# EAGLE design CristmasVillage Driver 1-3 (EAGLE 6.5.0)
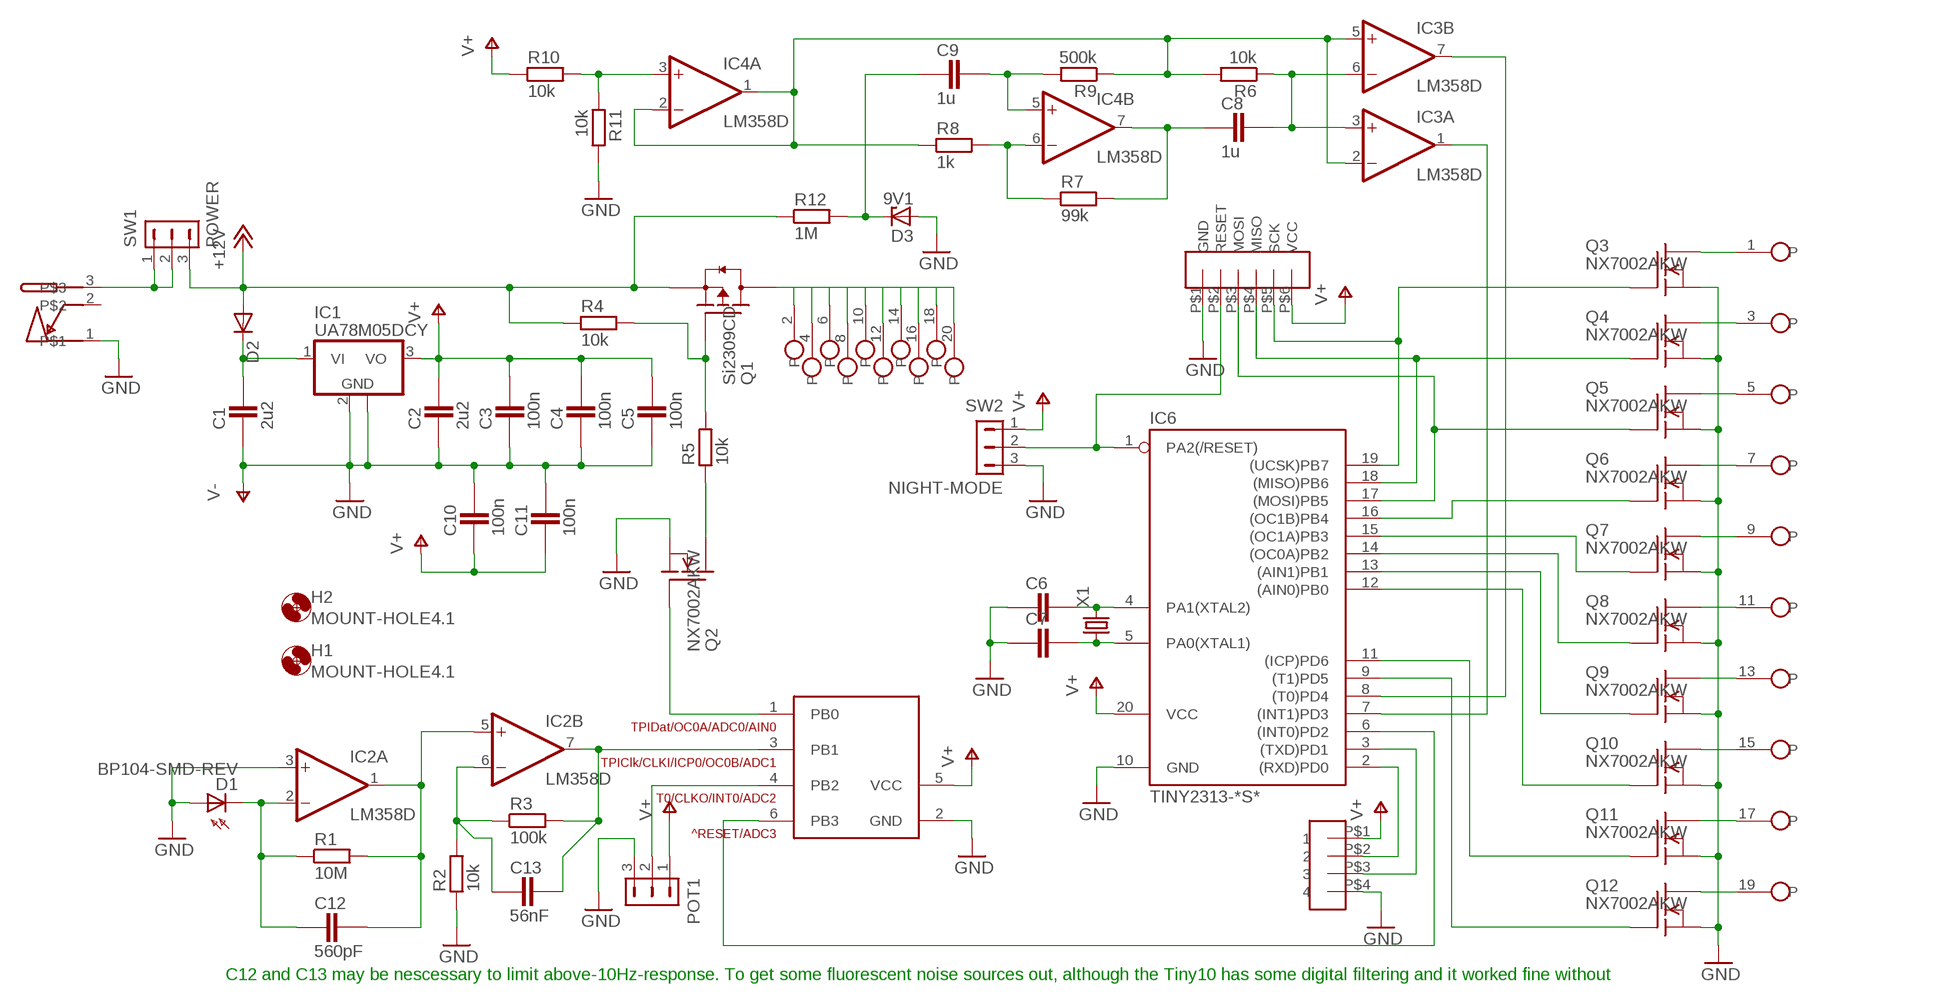
[diagram p0: schematic, sheet 1]

## Parts
C1  2u2  CAPACITOR_1206  [CAPC3215X168N]
C2  2u2  CAPACITOR_1206  [CAPC3215X168N]
C3  100n  CAPACITOR_0603  [CAPC1608X92N]
C4  100n  CAPACITOR_0603  [CAPC1608X92N]
C5  100n  CAPACITOR_0603  [CAPC1608X92N]
C6  CAPACITOR_0603  [CAPC1608X92N]
C7  CAPACITOR_0603  [CAPC1608X92N]
C8  1u  CAPACITOR_1206  [CAPC3215X168N]
C9  1u  CAPACITOR_1206  [CAPC3215X168N]
C10  100n  CAPACITOR_0603  [CAPC1608X92N]
C11  100n  CAPACITOR_0603  [CAPC1608X92N]
C12  560pF  CAPACITOR_0603  [CAPC1608X92N]
C13  56nF  CAPACITOR_0603  [CAPC1608X92N]
CN1  MJ-180SMT  [MJ-180SMT]
CN2-PROG  JST-6PSPI-SIDE-S6B  [6P-H]
CN3-SERIAL  JST-4PSIDE-S4B  [4P-H]
CN5-LEDSTRIPS  HDR_2X10_SIDE-MOUNT  [20PIN-10TOP-10BOT]
D1  BP104-SMD-REV  [BR104SMDREV]
D2  DIODE-MINIMELF  [MINIMELF]
D3  9V1  ZENER-DIODESOT23  [SOT23]
H1  MOUNT-HOLE4.1  [4,1]
H2  MOUNT-HOLE4.1  [4,1]
IC1  UA78M05DCY  [SOT223]
IC2  LM358D  [SO08]
IC3  LM358D  [SO08]
IC4  LM358D  [SO08]
IC5  ATTINY-4/5/9/10  [SOT23-6]
IC6  TINY2313-*S*  [SO20L$]
POT1  HDR-1X3-MTE-100  [MTE-100-3V]
Q1  Si2309CD  MOSFET-PCH_SOT-23  [SOT95P280X135-3N]
Q2  NX7002AKW  [SOT323R]
Q3  NX7002AKW  [SOT323R]
Q4  NX7002AKW  [SOT323R]
Q5  NX7002AKW  [SOT323R]
Q6  NX7002AKW  [SOT323R]
Q7  NX7002AKW  [SOT323R]
Q8  NX7002AKW  [SOT323R]
Q9  NX7002AKW  [SOT323R]
Q10  NX7002AKW  [SOT323R]
Q11  NX7002AKW  [SOT323R]
Q12  NX7002AKW  [SOT323R]
R1  10M  RESISTOR_0603  [RESC1608X55N]
R2  10k  RESISTOR_0603  [RESC1608X55N]
R3  100k  RESISTOR_0603  [RESC1608X55N]
R4  10k  RESISTOR_0603  [RESC1608X55N]
R5  10k  RESISTOR_0603  [RESC1608X55N]
R6  10k  RESISTOR_0603  [RESC1608X55N]
R7  99k  RESISTOR_0603  [RESC1608X55N]
R8  1k  RESISTOR_0603  [RESC1608X55N]
R9  500k  RESISTOR_0603  [RESC1608X55N]
R10  10k  RESISTOR_0603  [RESC1608X55N]
R11  10k  RESISTOR_0603  [RESC1608X55N]
R12  1M  RESISTOR_0603  [RESC1608X55N]
SW1  POWER  HDR-1X3-MTE-100  [MTE-100-3V]
SW2  NIGHT-MODE  HDR-1X3-MTE-100  [MTE-100-3V]
X1  CRYSTALSM49  [SM49]

## Nets
+12V: D2.A Q1.2(S) R4.1 R12.1 SW1.3
GND: C1.1 C2.1 C3.1 C4.1 C5.1 C6.1 C7.1 C10.2 C11.2 CN1.1 CN2-PROG.P$1(GND) CN3-SERIAL.P$4 D1.1(A) D3.1(A) IC1.2(GND) IC1.4(GND) IC2.3(A:+IN) IC5.2(GND) IC6.10(GND) POT1.3 Q2.2(S) Q3.2(S) Q4.2(S) Q5.2(S) Q6.2(S) Q7.2(S) Q8.2(S) Q9.2(S) Q10.2(S) Q11.2(S) Q12.2(S) R2.1 R11.2 SW2.3 ; supply symbol labelled V-
HALF-VCC: IC3.2(A:-IN) IC3.5(B:+IN) IC4.1(A:OUT) IC4.2(A:-IN) R6.2 R8.1 R9.1
MISO: CN2-PROG.P$4(MISO) IC6.18((MISO)PB6) Q4.1(G)
MOSI: CN2-PROG.P$3(MOSI) IC6.17((MOSI)PB5) Q5.1(G)
N$1: C1.2 D2.C IC1.1(VI)
N$2: C12.1 D1.2(C) IC2.2(A:-IN) R1.1
N$3: C12.2 IC2.1(A:OUT) IC2.5(B:+IN) R1.2
N$6: C13.1 IC2.6(B:-IN) R2.2 R3.1
N$7: C13.2 IC2.7(B:OUT) IC5.3(PB1) R3.2
N$8: IC6.9((T1)PD5) Q12.1(G)
N$9: IC5.1(PB0) Q2.1(G)
N$10: IC6.11((ICP)PD6) Q11.1(G)
N$11: C6.2 IC6.4(PA1(XTAL2)) X1.2
N$12: C7.2 IC6.5(PA0(XTAL1)) X1.1
N$13: IC6.12((AIN0)PB0) Q10.1(G)
N$14: IC6.13((AIN1)PB1) Q9.1(G)
N$15: IC6.14((OC0A)PB2) Q8.1(G)
N$16: IC6.15((OC1A)PB3) Q7.1(G)
N$17: CN2-PROG.P$2(RESET) IC6.1(PA2(/RESET)) SW2.2
N$18: IC5.6(PB3) IC6.6((INT0)PD2)
N$19: IC5.4(PB2) POT1.2
N$20: IC6.16((OC1B)PB4) Q6.1(G)
N$21: CN5-LEDSTRIPS.1 Q3.3(D)
N$22: CN1.3 SW1.1 SW1.2
N$23: CN5-LEDSTRIPS.3 Q4.3(D)
N$24: CN5-LEDSTRIPS.5 Q5.3(D)
N$25: CN5-LEDSTRIPS.7 Q6.3(D)
N$26: CN5-LEDSTRIPS.9 Q7.3(D)
N$27: CN5-LEDSTRIPS.11 Q8.3(D)
N$28: CN5-LEDSTRIPS.13 Q9.3(D)
N$29: CN5-LEDSTRIPS.15 Q10.3(D)
N$30: CN5-LEDSTRIPS.17 Q11.3(D)
N$31: CN5-LEDSTRIPS.19 Q12.3(D)
N$32: CN5-LEDSTRIPS.2 CN5-LEDSTRIPS.4 CN5-LEDSTRIPS.6 CN5-LEDSTRIPS.8 CN5-LEDSTRIPS.10 CN5-LEDSTRIPS.12 CN5-LEDSTRIPS.14 CN5-LEDSTRIPS.16 CN5-LEDSTRIPS.18 CN5-LEDSTRIPS.20 Q1.3(D)
N$33: Q1.1(G) R4.2 R5.2
N$34: Q2.3(D) R5.1
N$35: IC3.1(A:OUT) IC6.7((INT1)PD3)
N$36: IC3.7(B:OUT) IC6.8((T0)PD4)
N$37: C8.2 IC3.3(A:+IN) IC3.6(B:-IN) R6.1
N$38: IC4.3(A:+IN) R10.2 R11.1
N$39: C8.1 IC4.7(B:OUT) R7.2
N$40: IC4.6(B:-IN) R7.1 R8.2
N$41: C9.2 IC4.5(B:+IN) R9.2
N$42: C9.1 D3.3(C) R12.2
RX: CN3-SERIAL.P$2 IC6.2((RXD)PD0)
SCK: CN2-PROG.P$5(SCK) IC6.19((UCSK)PB7) Q3.1(G)
TX: CN3-SERIAL.P$3 IC6.3((TXD)PD1)
V+: C2.2 C3.2 C4.2 C5.2 C10.1 C11.1 CN2-PROG.P$6(VCC) CN3-SERIAL.P$1 IC1.3(VO) IC5.5(VCC) IC6.20(VCC) POT1.1 R10.1 SW2.1
Unconnected: CN1.2

## Notes on the sheet
- C12 and C13 may be nescessary to limit above-10Hz-response. To get some fluorescent noise sources out, although the Tiny10 has some digital filtering and it worked fine without

## Power pins joined to a net without a drawn wire
GND: IC2.4(P:V-) IC3.4(P:V-) IC4.4(P:V-)
V+: IC2.8(P:V+) IC3.8(P:V+) IC4.8(P:V+)

## Library data of the parts
C1-C13 = ipc-7351-capacitor:CAPACITOR_
CN1 = con-Multicomp:MJ-180SMT
CN2-PROG = avr-6:JST-6P
CN3-SERIAL = Connector-2mm:JST-4P
CN5-LEDSTRIPS = con-SideHeader:HDR_2X10_SIDE-MOUNT
D1 = Vishay:BP104: PHOTO DIODE
D2 = diode:DIODE-: DIODE
D3 = diode:ZENER-DIODE: Z-Diode
H1 H2 = holes:MOUNT-HOLE: MOUNTING HOLE with drill center marker
IC1 = linear:UA78M*: POSITIVE-VOLTAGE REGULATORS Source: http://focus.ti.com/lit/ds/symlink/ua78m33.pdf
IC2-IC4 = linear4:LM358: OP AMP
IC5 = avr-6:ATTINY-4/5/9/10
IC6 = avr-6:TINY2313*: Atmel Tiny2313 2K Flash, 128 bytes EEPROM, 128 bytes RAM
POT1 SW1 SW2 = con-hdrs40:HDR-1X3: HEADER CONNECTOR
Q1 = ipc-7351-transistor:MOSFET-PCH_
Q2-Q12 = ZeroCross Project:NX7002AKW
R1-R12 = ipc-7351-resistor:RESISTOR_
X1 = crystal:CRYSTAL: CRYSTAL

## Board
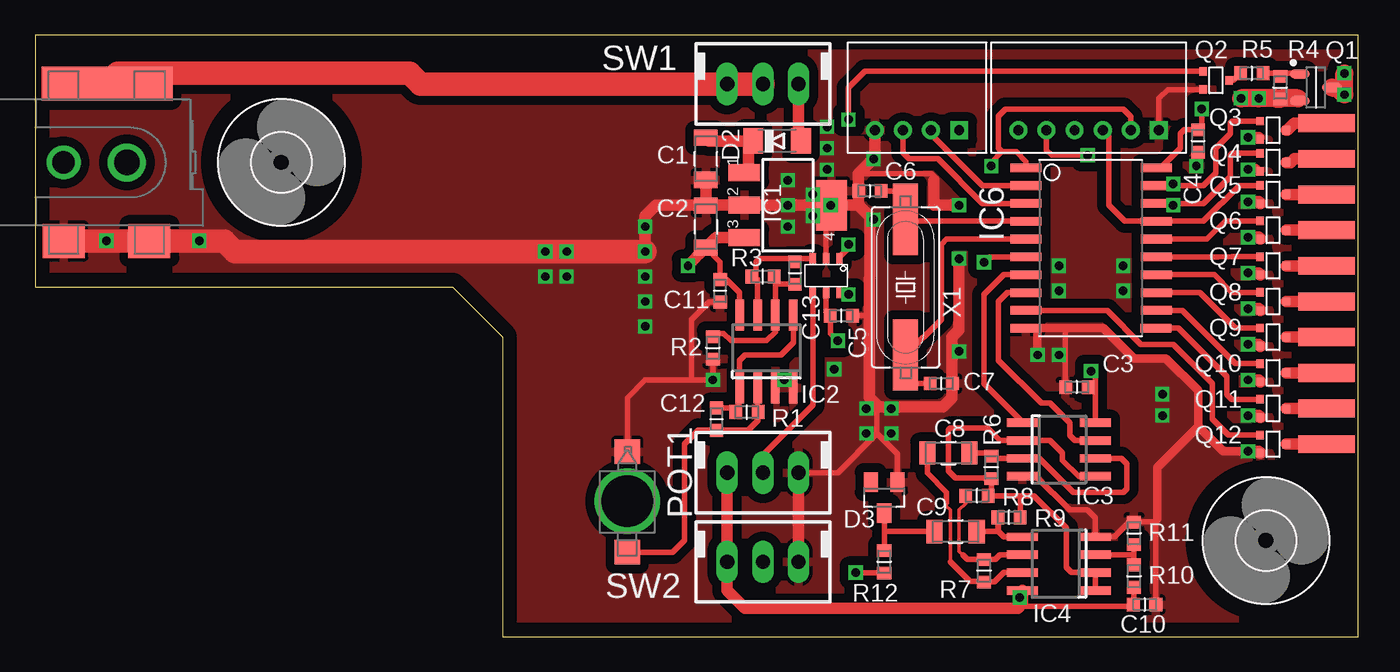
[diagram p1: board, top side]
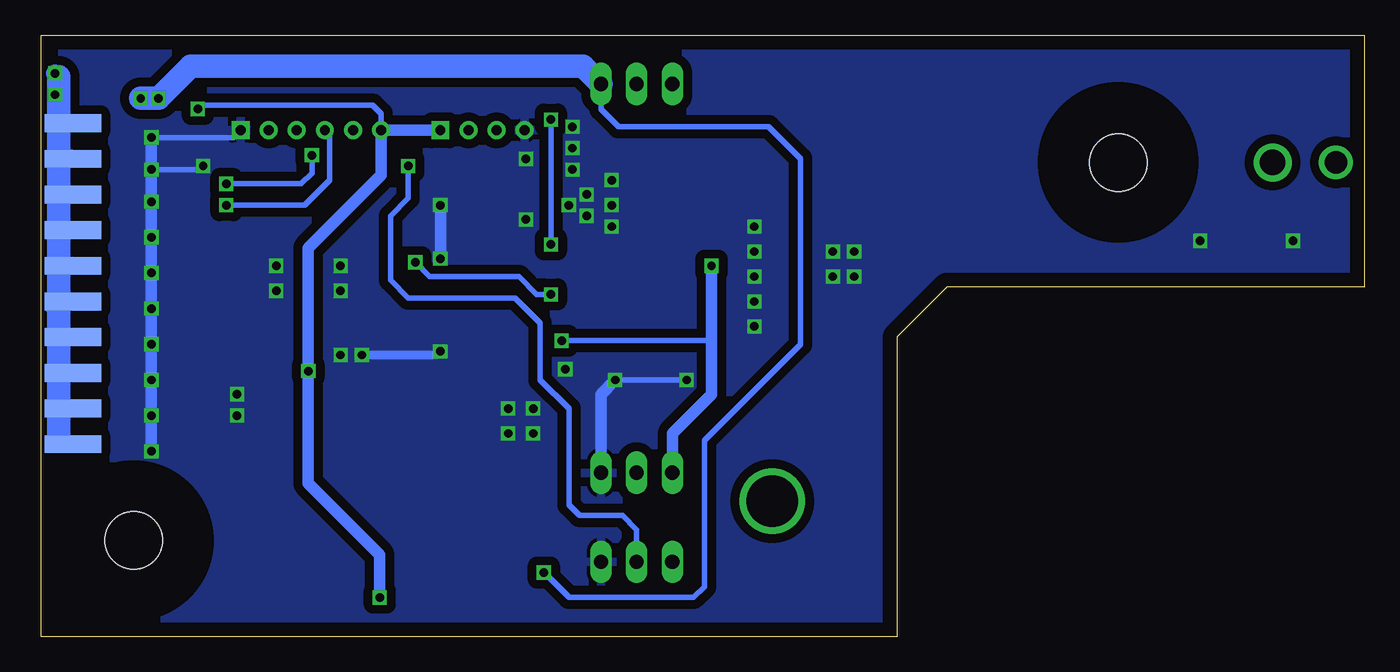
[diagram p2: board, bottom side, seen from below]

Size 94.21 x 42.85 mm. Coordinates in mm from the lower left corner, seen from the top.
Outline: 33.27,0 94.21,0 94.21,42.85 0,42.85 0,24.89 29.72,24.89 33.27,21.34 33.27,0
Copper layers (1*16): Top 0.035mm / dielectric 1.5mm / Bottom 0.035mm
Design rules "default": minimum track width 10mil, minimum drill 24mil, track to track 8mil, track to pad 8mil, pad to pad 8mil, via to via 8mil, smd to smd 8mil, copper to edge 40mil, drill to drill 8mil, minimum pad ring 10mil, minimum via ring 8mil, stop-mask expansion 4mil, vias tented up to drill 0mil, thermal gap 10mil

### Footprints (pad centres in the part's own frame; a part is rotated, then mirrored left to right if it is on the bottom)
CAPC3215X168N = smd 1.15 x 1.65: 1 -1.5,0; 2 1.5,0
CAPC1608X92N = smd 0.9 x 0.95: 1 -0.8,0; 2 0.8,0
MJ-180SMT = smd 3 x 2.4: 1 0,-5.6; 2 6.1,-5.6 | smd 9.3 x 2.4: 3 3.1,5.6 | drill 1.6 pad 1.93: P$1 0,0 | drill 1.8 pad 2.184: P$2 4.5,0
6P-H = drill 0.7 pad 1.27 square: P$1 0,0 | drill 0.7 pad 1.27: P$2 2,0; P$3 4,0; P$4 6,0; P$5 8,0; P$6 10,0
4P-H = drill 0.7 pad 1.27 square: P$1 0,0 | drill 0.7 pad 1.27: P$2 2,0; P$3 4,0; P$4 6,0
20PIN-10TOP-10BOT = smd 1.27 x 4: 1 0,0; 3 2.54,0; 5 5.08,0; 7 7.62,0; 9 10.16,0; 11 12.7,0; 13 15.24,0; 15 17.78,0; 17 20.32,0; 19 22.86,0 | smd 1.27 x 4 bottom: 2 0,0; 4 2.54,0; 6 5.08,0; 8 7.62,0; 10 10.16,0; 12 12.7,0; 14 15.24,0; 16 17.78,0; 18 20.32,0; 20 22.86,0
BR104SMDREV = smd 1.75 x 1.8: 1 -3.525,0; 2 3.625,0 | drill 3.65 pad 3.95: P$1 0,0
MINIMELF = smd 1.4 x 1.8: A 1.7,0; C -1.7,0
SOT23 = smd 1 x 1.4: 1 -0.95,-1.1; 2 0.95,-1.1; 3 0,1.1
4,1 = hole 4.1: 0,0
SOT223 = smd 1.219 x 2.235: 1 -2.311,-3.099; 2 0,-3.099; 3 2.311,-3.099 | smd 3.6 x 2.2: 4 0,3.099
SO08 = smd 0.6 x 2.2: 1 -1.905,-2.6; 2 -0.635,-2.6; 3 0.635,-2.6; 4 1.905,-2.6; 5 1.905,2.6; 6 0.635,2.6; 7 -0.635,2.6; 8 -1.905,2.6
SOT23-6 = smd 0.8 x 0.45: 1 0,1.9; 2 0,0.95; 3 0,0; 4 2.4,0; 5 2.4,0.95; 6 2.4,1.9
SO20L$ = smd 0.61 x 2.21: 1 -5.715,-4.636; 2 -4.445,-4.636; 3 -3.175,-4.636; 4 -1.905,-4.636; 5 -0.635,-4.636; 6 0.635,-4.636; 7 1.905,-4.636; 8 3.175,-4.636; 9 4.445,-4.636; 10 5.715,-4.636; 11 5.715,4.61; 12 4.445,4.636; 13 3.175,4.636; 14 1.905,4.636; 15 0.635,4.636; 16 -0.635,4.636; 17 -1.905,4.636; 18 -3.175,4.636; 19 -4.445,4.636; 20 -5.715,4.636
MTE-100-3V = drill 1.016 long: 1 -2.54,0; 2 0,0; 3 2.54,0
SOT95P280X135-3N = smd 1.4 x 0.65: 1 -1.15,0.95; 2 -1.15,-0.95; 3 1.15,0
SOT323R = smd 0.6 x 0.55: 1 -0.65,-0.925; 2 0.65,-0.925; 3 0,0.925
RESC1608X55N = smd 0.9 x 1: 1 -0.8,0; 2 0.8,0
SM49 = smd 5.08 x 1.778: 1 -4.826,0; 2 4.826,0

### Placement (x,y rotation side)
C1  47.75,34.04 90 top
C2  47.75,29.21 270 top
C3  74.17,17.78 0 top
C4  82.8,35.31 90 top
C5  57.4,22.86 180 top
C6  59.44,31.75 0 top
C7  64.52,18.03 180 top
C8  65.02,13.08 0 top
C9  65.53,7.49 0 top
C10  78.99,2.29 0 top
C11  48.77,24.64 270 top
C12  48.51,15.49 90 top
C13  54.1,25.91 90 top
CN1  2.03,33.78 0 top
CN2-PROG  80.01,36.07 180 top
CN3-SERIAL  65.79,36.07 180 top
CN5-LEDSTRIPS  91.95,36.58 270 top
D1  42.16,9.65 270 top
D2  52.83,35.31 0 top
D3  60.45,9.91 180 top
H1  87.63,6.86 0 top
H2  17.53,33.78 0 top
IC1  53.59,30.73 270 top
IC2  52.07,20.32 0 top
IC3  72.9,13.34 270 top
IC4  72.9,5.21 90 top
IC5  55.37,26.92 270 top
IC6  75.18,27.69 270 top
POT1  51.82,11.68 0 top
Q1  91.19,39.12 0 top
Q2  84.07,39.62 270 top
Q3  88.14,36.07 270 top
Q4  88.14,33.78 270 top
Q5  88.14,31.5 270 top
Q6  88.14,28.96 270 top
Q7  88.14,26.42 270 top
Q8  88.14,23.88 270 top
Q9  88.14,21.34 270 top
Q10  88.14,18.8 270 top
Q11  88.14,16.26 270 top
Q12  88.14,13.72 270 top
R1  50.67,16 180 top
R2  48.26,20.57 90 top
R3  51.82,25.65 180 top
R4  88.65,39.12 90 top
R5  86.61,40.13 0 top
R6  68.07,12.06 270 top
R7  67.56,4.7 270 top
R8  67.06,10.03 180 top
R9  69.34,8.51 180 top
R10  78.23,4.32 90 top
R11  78.23,7.37 90 top
R12  60.45,5.33 90 top
SW1  51.82,39.37 0 top
SW2  51.82,5.33 0 top
X1  61.98,24.89 90 top

### Tracks (layer width: path | path; a pad name or v marks a point on that pad's centre or on a via)
+12V  (via drill 0.6)
  Top 0.406: R12.1 58.46,4.53 v58.42,4.57
  Top 0.813: Q1.2 90.04,38.23 89.92,38.35 | SW1.3 54.36,35.38 D2.A
  Top 1.27: 89.92,38.35 88.68,38.35 R4.1 88.43,38.32 88.39,38.35 v87.12,38.35 v85.85,38.35
  Bottom 0.406: v58.42,4.57 56.64,2.79 47.75,2.79 46.99,3.56 46.99,13.97 40.13,20.83 40.13,34.04 42.42,36.32 53.09,36.32 54.36,37.59 SW1.3
  Bottom 1.676: SW1.3 55.63,40.64 83.57,40.64 v85.85,38.35 v87.12,38.35
GND  (via drill 0.6)
  Top 0.305: 55.81,30.67 55.88,30.73
  Top 0.406: Q3.2 87.21,35.47 87.12,35.56 | 86.87,33.27 87.07,33.27 Q4.2 | CN2-PROG.P$1 80.01,38.35 80.63,38.97 Q2.2 | C4.1 82.8,33.66 v82.68,33.53 | 58.64,32.98 63.79,32.98 64.01,32.77 64.01,32.51 | C3.1 73.37,21.93 73.41,21.97 | IC3.4 71.25,11.43 73.66,9.02 74.93,9.02 75.5,8.45 IC4.4 76.83,7.11 77.89,8.17 R11.2 79.76,8.17 79.79,8.13 | C10.2 79.79,8.13 | 79.79,8.13 79.79,8.29 79.88,8.38 | IC5.2 56.32,30.36 IC1.4 | C5.1 59.16,22.86 59.42,22.6 | IC6.10 71.25,21.97 71.37,21.84 | R2.1 v48.26,18.29 46.74,18.29 | IC2.4 53.91,18.29 v53.34,18.29 52.83,18.29 52.77,18.23 IC2.3 | 46.74,18.29 46.74,22.61 47.97,23.84 C11.2 | 42.64,13.18 D1.1 42.16,17.02 43.43,18.29 46.74,18.29 | 59.94,16.38 59.94,14.48 | 59.94,14.48 61.4,13.02 D3.1 | POT1.3 57.15,11.68 59.94,14.48
  Top 0.61: IC6.10 73.41,21.97 76.07,21.97 78.23,19.81 80.52,19.81 82.8,17.53 82.8,14.99 | 82.8,14.99 84.58,13.21 v86.36,13.21 | 79.88,8.38 79.88,12.06 82.8,14.99 | 71.37,21.84 v71.37,20.07
  Top 0.813: 87.12,35.56 v86.36,35.56 | v86.36,33.27 86.87,33.27 | Q5.2 87.21,30.9 87.12,30.99 v86.36,30.99 | Q6.2 87.21,28.36 87.12,28.45 v86.36,28.45 | Q7.2 87.21,25.82 87.12,25.91 v86.36,25.91 | Q8.2 87.21,23.28 87.12,23.37 v86.36,23.37 | Q9.2 87.21,20.74 87.12,20.83 v86.36,20.83 | Q10.2 87.21,18.2 87.12,18.29 v86.36,18.29 | Q11.2 87.21,15.66 87.12,15.75 v86.36,15.75 | Q12.2 87.21,13.12 87.12,13.21 v86.36,13.21 | 58.64,30.73 C6.1 58.64,32.98 v59.69,34.04 59.79,34.13 CN3-SERIAL.P$4 | 58.64,30.73 59.44,29.93 59.44,28.7 59.42,22.6 59.4,17.06 60.07,16.38 | v65.79,26.92 65.79,21.84 65.28,21.34 65.28,18.07 C7.1 65.28,18 65.28,17.02 64.64,16.38 60.07,16.38 | v65.79,30.73 64.01,30.73 64.01,32.51 | 59.94,16.38 60.07,16.38 | SW2.3 POT1.3 | C1.1 C2.1 | C2.1 47.78,30.73 IC1.2 v53.59,30.73 55.88,30.73 v56.64,30.73 IC1.4 58.64,30.73 | v43.43,27.43 v43.43,29.21 43.43,29.97 44.2,30.73 47.73,30.73 C2.1
  Top 1.676: CN1.1 8.12,28.18 8.13,28.19 v11.68,28.19 13.46,28.19 14.22,27.43 v36.32,27.43 v37.85,27.43 v43.43,27.43
  Bottom 0.406: v86.36,35.56 80.52,35.56 CN2-PROG.P$1 | v82.68,33.53 82.93,33.27 v86.36,33.27 | v48.26,18.29 v53.34,18.29
  Bottom 0.61: v71.37,20.07 66.04,20.07
  Bottom 0.813: v86.36,35.56 v86.36,33.27 v86.36,30.99 v86.36,28.45 v86.36,25.91 v86.36,23.37 v86.36,20.83 v86.36,18.29 v86.36,15.75 v86.36,13.21 | v65.79,30.73 v65.79,26.92 | POT1.3 54.36,17.27 v53.34,18.29
  other vias: 43.43,25.65 43.43,23.88 59.18,16.26 72.9,20.07 80.26,17.27 80.26,15.75 5.08,28.19 56.39,36.32 56.39,34.8 56.39,33.27 53.59,32.51 53.59,29.21 55.37,29.97 55.37,31.5 36.32,25.65 37.85,25.65 43.43,22.1 60.96,16.26 59.18,14.48 60.96,14.48 65.79,20.32 72.9,26.42 72.9,24.64 77.47,26.42 77.47,24.64 59.69,29.72 56.9,19.05
  pour Bottom (isolate 0.635): 33.27,21.34 29.72,24.89 0,24.89 0,42.93 94.23,42.93 94.23,0 33.27,0
  pour Top (isolate 0.635): 0,24.89 0,41.4 1.52,42.93 94.23,42.93 94.23,0 33.27,0 33.27,21.34 29.72,24.89
HALF-VCC
  Top 0.406: IC3.5 74.3,11.43 73.15,12.57 73.15,13.08 72.26,13.97 IC3.2 68.71,13.97 67.82,14.86 65.15,14.86 65.02,14.73 65.02,11.81 65.53,11.3 67.56,11.3 67.6,11.27 R6.2 68.07,10.25 R8.1 70.1,10.03 | IC4.1 IC4.2 73.79,4.57 73.41,4.95 73.41,7.75 71.12,10.03 70.1,10.03 | R9.1 70.14,9.99 70.1,10.03
MISO  (via drill 0.6)
  Top 0.406: Q4.1 85.23,34.43 85.09,34.29 85.09,32.77 83.19,30.86 IC6.18 80.9,30.86 v81.03,30.73
  Bottom 0.406: v81.03,30.73 75.44,30.73 73.66,32.51 73.66,35.72 CN2-PROG.P$4
MOSI
  Top 0.406: Q5.1 85.74,32.15 83.19,29.59 IC6.17 77.6,29.59 76.45,30.73 76.45,35.62 CN2-PROG.P$3
N$1
  Top 0.813: C1.2 47.98,35.31 D2.C 50.8,34.8 50.8,33.43 50.88,33.43 IC1.1
N$2
  Top 0.406: IC2.2 51.44,16.55 R1.1 51.47,15.4 50.8,14.73 48.51,14.73 | D1.2 45.4,6.03 46.23,6.86 46.23,13.72 47.24,14.73 48.51,14.73 | C12.1 48.51,14.73
N$3
  Top 0.406: IC2.5 53.98,20.95 53.09,20.07 50.55,20.07 50.16,19.68 IC2.1 50.16,16.8 R1.2 49.87,16.29 C12.2
N$6
  Top 0.406: 52.7,25.11 IC2.6 52.7,21.72 52.07,21.08 49.53,21.08 49.02,21.59 48.55,21.59 R2.2 | 52.7,25.11 52.7,25.49 R3.1 | C13.1 52.7,25.11
N$7
  Top 0.406: IC5.3 53.85,26.92 | 53.85,26.92 51.56,26.92 51.31,26.67 51.31,25.69 R3.2 51.44,25.49 IC2.7 | C13.2 53.85,26.71 53.85,26.92
N$8
  Top 0.406: IC6.9 76.33,23.24 78.74,20.83 81.03,20.83 83.82,18.03 83.82,15.49 84.95,14.37 Q12.1
N$9  (via drill 0.6)
  Top 0.406: IC5.1 57.27,27.05 57.91,27.69 v57.91,27.94 | v57.91,36.83 57.91,39.12 59.07,40.27 Q2.1
  Bottom 0.406: v57.91,27.94 v57.91,36.83
N$10
  Top 0.406: IC6.11 81.41,21.97 84.84,18.54 84.84,17.27 85.2,16.91 Q11.1
N$11
  Top 0.406: IC6.4 62.1,29.59 X1.2 61.98,31.5 61.72,31.75 C6.2
N$12
  Top 0.406: IC6.5 64.9,28.32 64.52,27.94 64.52,22.61 X1.1 61.98,18.54 62.48,18.03 C7.2
N$13
  Top 0.406: IC6.12 81.66,23.24 85.46,19.45 Q10.1
N$14
  Top 0.406: IC6.13 82.93,24.51 85.46,21.99 Q9.1
N$15
  Top 0.406: IC6.14 83.95,25.78 85.2,24.53 Q8.1
N$16
  Top 0.406: Q7.1 85.23,27.07 84.2,27.05 IC6.15
N$17  (via drill 0.6)
  Top 0.406: CN2-PROG.P$2 78.01,37.05 77.47,37.59 69.09,37.59 68.58,37.08 68.58,34.8 68.83,34.54 | 68.83,34.54 69.85,34.54 70.55,33.85 IC6.1 | v68.07,33.53 68.07,33.78 68.83,34.54
  Bottom 0.406: SW2.2 51.82,7.62 52.83,8.64 55.88,8.64 56.64,9.4 56.64,16.26 58.67,18.29 58.67,22.35 60.45,24.13 68.07,24.13 69.34,25.4 69.34,29.97 68.07,31.24 v68.07,33.53
N$18  (via drill 0.6)
  Top 0.406: 67.82,26.92 v67.56,26.67 67.94,27.05 IC6.6 | v57.91,24.38 57.41,24.38 IC5.6
  Bottom 0.406: v57.91,24.38 58.93,24.38 60.2,25.65 66.55,25.65 v67.56,26.67
N$19
  Top 0.406: POT1.2 51.82,12.95 55.37,16.51 IC5.4
N$20
  Top 0.406: IC6.16 83.44,28.32 84.72,29.61 Q6.1
N$21
  Top 0.813: Q3.3 89.15,36.07 89.66,36.58 CN5-LEDSTRIPS.1
N$22
  Top 1.676: SW1.2 SW1.1 27.43,39.37 26.67,40.13 5.88,40.13 CN1.3
N$23
  Top 0.813: Q4.3 89.41,33.78 89.66,34.04 CN5-LEDSTRIPS.3
N$24
  Top 0.813: Q5.3 CN5-LEDSTRIPS.5
N$25
  Top 0.813: Q6.3 CN5-LEDSTRIPS.7
N$26
  Top 0.813: Q7.3 CN5-LEDSTRIPS.9
N$27
  Top 0.813: Q8.3 CN5-LEDSTRIPS.11
N$28
  Top 0.813: Q9.3 CN5-LEDSTRIPS.13
N$29
  Top 0.813: Q10.3 CN5-LEDSTRIPS.15
N$30
  Top 0.813: Q11.3 CN5-LEDSTRIPS.17
N$31
  Top 0.813: Q12.3 CN5-LEDSTRIPS.19
N$32  (via drill 0.6)
  Top 1.27: Q1.3 92.71,39.12 v93.22,38.61 v93.22,40.13
  Bottom 0.61: 93.22,16 92.96,16 | 93.22,18.54 92.96,18.54 | 93.22,21.08 92.96,21.08 | 93.22,23.37 93.22,23.62 92.96,23.88 | 93.22,26.16 92.96,26.16 | 93.22,28.7 92.96,28.7 | CN5-LEDSTRIPS.6 92.46,31.5 92.96,30.99 | CN5-LEDSTRIPS.4 92.71,34.04 92.96,34.29 | 93.22,36.58 93.22,37.59 92.96,37.85
  Bottom 1.27: CN5-LEDSTRIPS.20 92.96,13.72 93.22,13.97 92.96,14.22 92.96,14.48 | CN5-LEDSTRIPS.18 92.96,16.26 93.22,16 | CN5-LEDSTRIPS.16 92.96,18.8 93.22,18.54 | CN5-LEDSTRIPS.14 92.96,21.34 93.22,21.08 | CN5-LEDSTRIPS.12 92.71,23.88 93.22,23.37 | CN5-LEDSTRIPS.10 92.96,26.42 93.22,26.16 | CN5-LEDSTRIPS.8 92.96,28.96 93.22,28.7 | CN5-LEDSTRIPS.6 92.96,31.5 | CN5-LEDSTRIPS.2 93.22,36.58 | CN5-LEDSTRIPS.4 93.22,34.04 | v93.22,40.13 92.96,39.88
  Bottom 1.676: 92.96,39.88 92.96,37.85 92.96,34.29 92.96,30.99 92.96,28.7 92.96,26.16 92.96,23.88 92.96,21.08 92.96,18.54 92.96,16 92.96,14.48
N$33
  Top 0.406: R5.2 88.65,40.13 | 88.65,40.13 89.97,40.13 Q1.1 | R4.2 88.65,40.13
N$34
  Top 0.406: Q2.3 85.31,39.62 R5.1
N$35
  Top 0.406: IC6.7 68.96,25.78 67.56,24.38 67.56,18.03 70.3,15.3 IC3.1
N$36
  Top 0.406: IC6.8 69.22,24.51 68.58,23.88 68.58,19.68 71.63,16.64 72.26,16.64 73.66,15.24 73.66,14.35 74.04,13.97 IC3.7
N$37
  Top 0.406: IC3.6 77.34,12.7 77.72,12.32 77.72,10.54 77.47,10.29 73.91,10.29 71.5,12.7 IC3.3 68.16,12.7 R6.1 67.6,13.08 C8.2
N$38
  Top 0.406: IC4.3 78.11,5.84 78.23,5.97 | 78.23,5.97 R10.2 | R11.1 78.23,5.97
N$39
  Top 0.254: 64.9,9.53 64.9,9.27 65.15,9.02 65.15,5.33
  Top 0.406: IC4.7 68.96,4.57 68.29,3.9 R7.2 67.53,3.94 66.55,3.94 65.15,5.33 | C8.1 63.52,11.66 64.9,10.29 64.9,9.53
N$40
  Top 0.254: R8.2 66.26,9.49 65.79,9.02 65.79,6.1 66.04,5.84 | 67.53,5.46 R7.1
  Top 0.406: IC4.6 68.71,5.84 68.36,5.5 R7.1 66.38,5.5 66.04,5.84
N$41
  Top 0.406: IC4.5 68.96,7.11 68.58,7.49 68.58,8.47 R9.2 68.54,7.49 C9.2
N$42
  Top 0.406: C9.1 60.45,7.49 | 60.45,7.49 R12.2 | D3.3 60.45,7.49
RX
  Top 0.406: CN3-SERIAL.P$2 63.79,35.78 67.44,32.13 IC6.2
SCK  (via drill 0.6)
  Top 0.406: Q3.1 85.23,36.72 85.09,36.58 85.09,35.81 84.07,34.8 84.07,33.02 83.19,32.13 IC6.19 80.9,32.13 v81.03,32.26 | v74.93,34.29 72.39,34.29 72.01,34.67 CN2-PROG.P$5
  Bottom 0.406: v81.03,32.26 75.69,32.26 74.93,33.02 v74.93,34.29
TX
  Top 0.406: IC6.3 67.44,30.86 64.26,34.04 62.23,34.04 61.79,34.48 CN3-SERIAL.P$3
V+  (via drill 0.6)
  Top 0.406: v83.06,37.59 83.06,36.32 82.84,36.11 C4.2 81.83,36.11 81.53,35.81 81.53,34.8 80.14,33.4 IC6.20 | IC3.8 75.5,17.78 | 75.5,17.78 75.5,18.61 v75.18,18.92 | C3.2 75.5,17.78 | R10.1 78.23,2.32 C10.1 78.07,2.16 70.36,2.16 | 70.1,2.16 70.36,2.16 | IC4.8 70.3,2.22 70.36,2.16 | IC5.5 56.32,23.14 | 56.32,23.14 C5.2 | IC2.8 50.16,24.51 49.24,25.44 C11.1 48.77,26.69 C2.2 | 56.32,23.14 56.64,23.14 56.64,21.59 v57.15,21.08
  Top 0.813: POT1.1 SW2.1 49.28,3.3 50.55,2.03 69.98,2.03 70.1,2.16 | IC1.3 48.47,28.42 C2.2 47.24,27.2 v46.48,26.42 | IC4.8 70.3,2.48 v70.1,2.79
  Bottom 0.406: v83.06,37.59 82.8,37.85 70.61,37.85 70.01,37.24 CN2-PROG.P$6 | v57.15,21.08 46.48,21.08
  Bottom 0.813: CN3-SERIAL.P$1 CN2-PROG.P$6 70.01,32.86 75.18,27.69 v75.18,18.92 75.18,10.92 70.1,5.84 v70.1,2.79 | POT1.1 49.28,14.48 46.48,17.27 46.48,21.08 v46.48,26.42